# Altium project Analog_Digital.PrjPcb
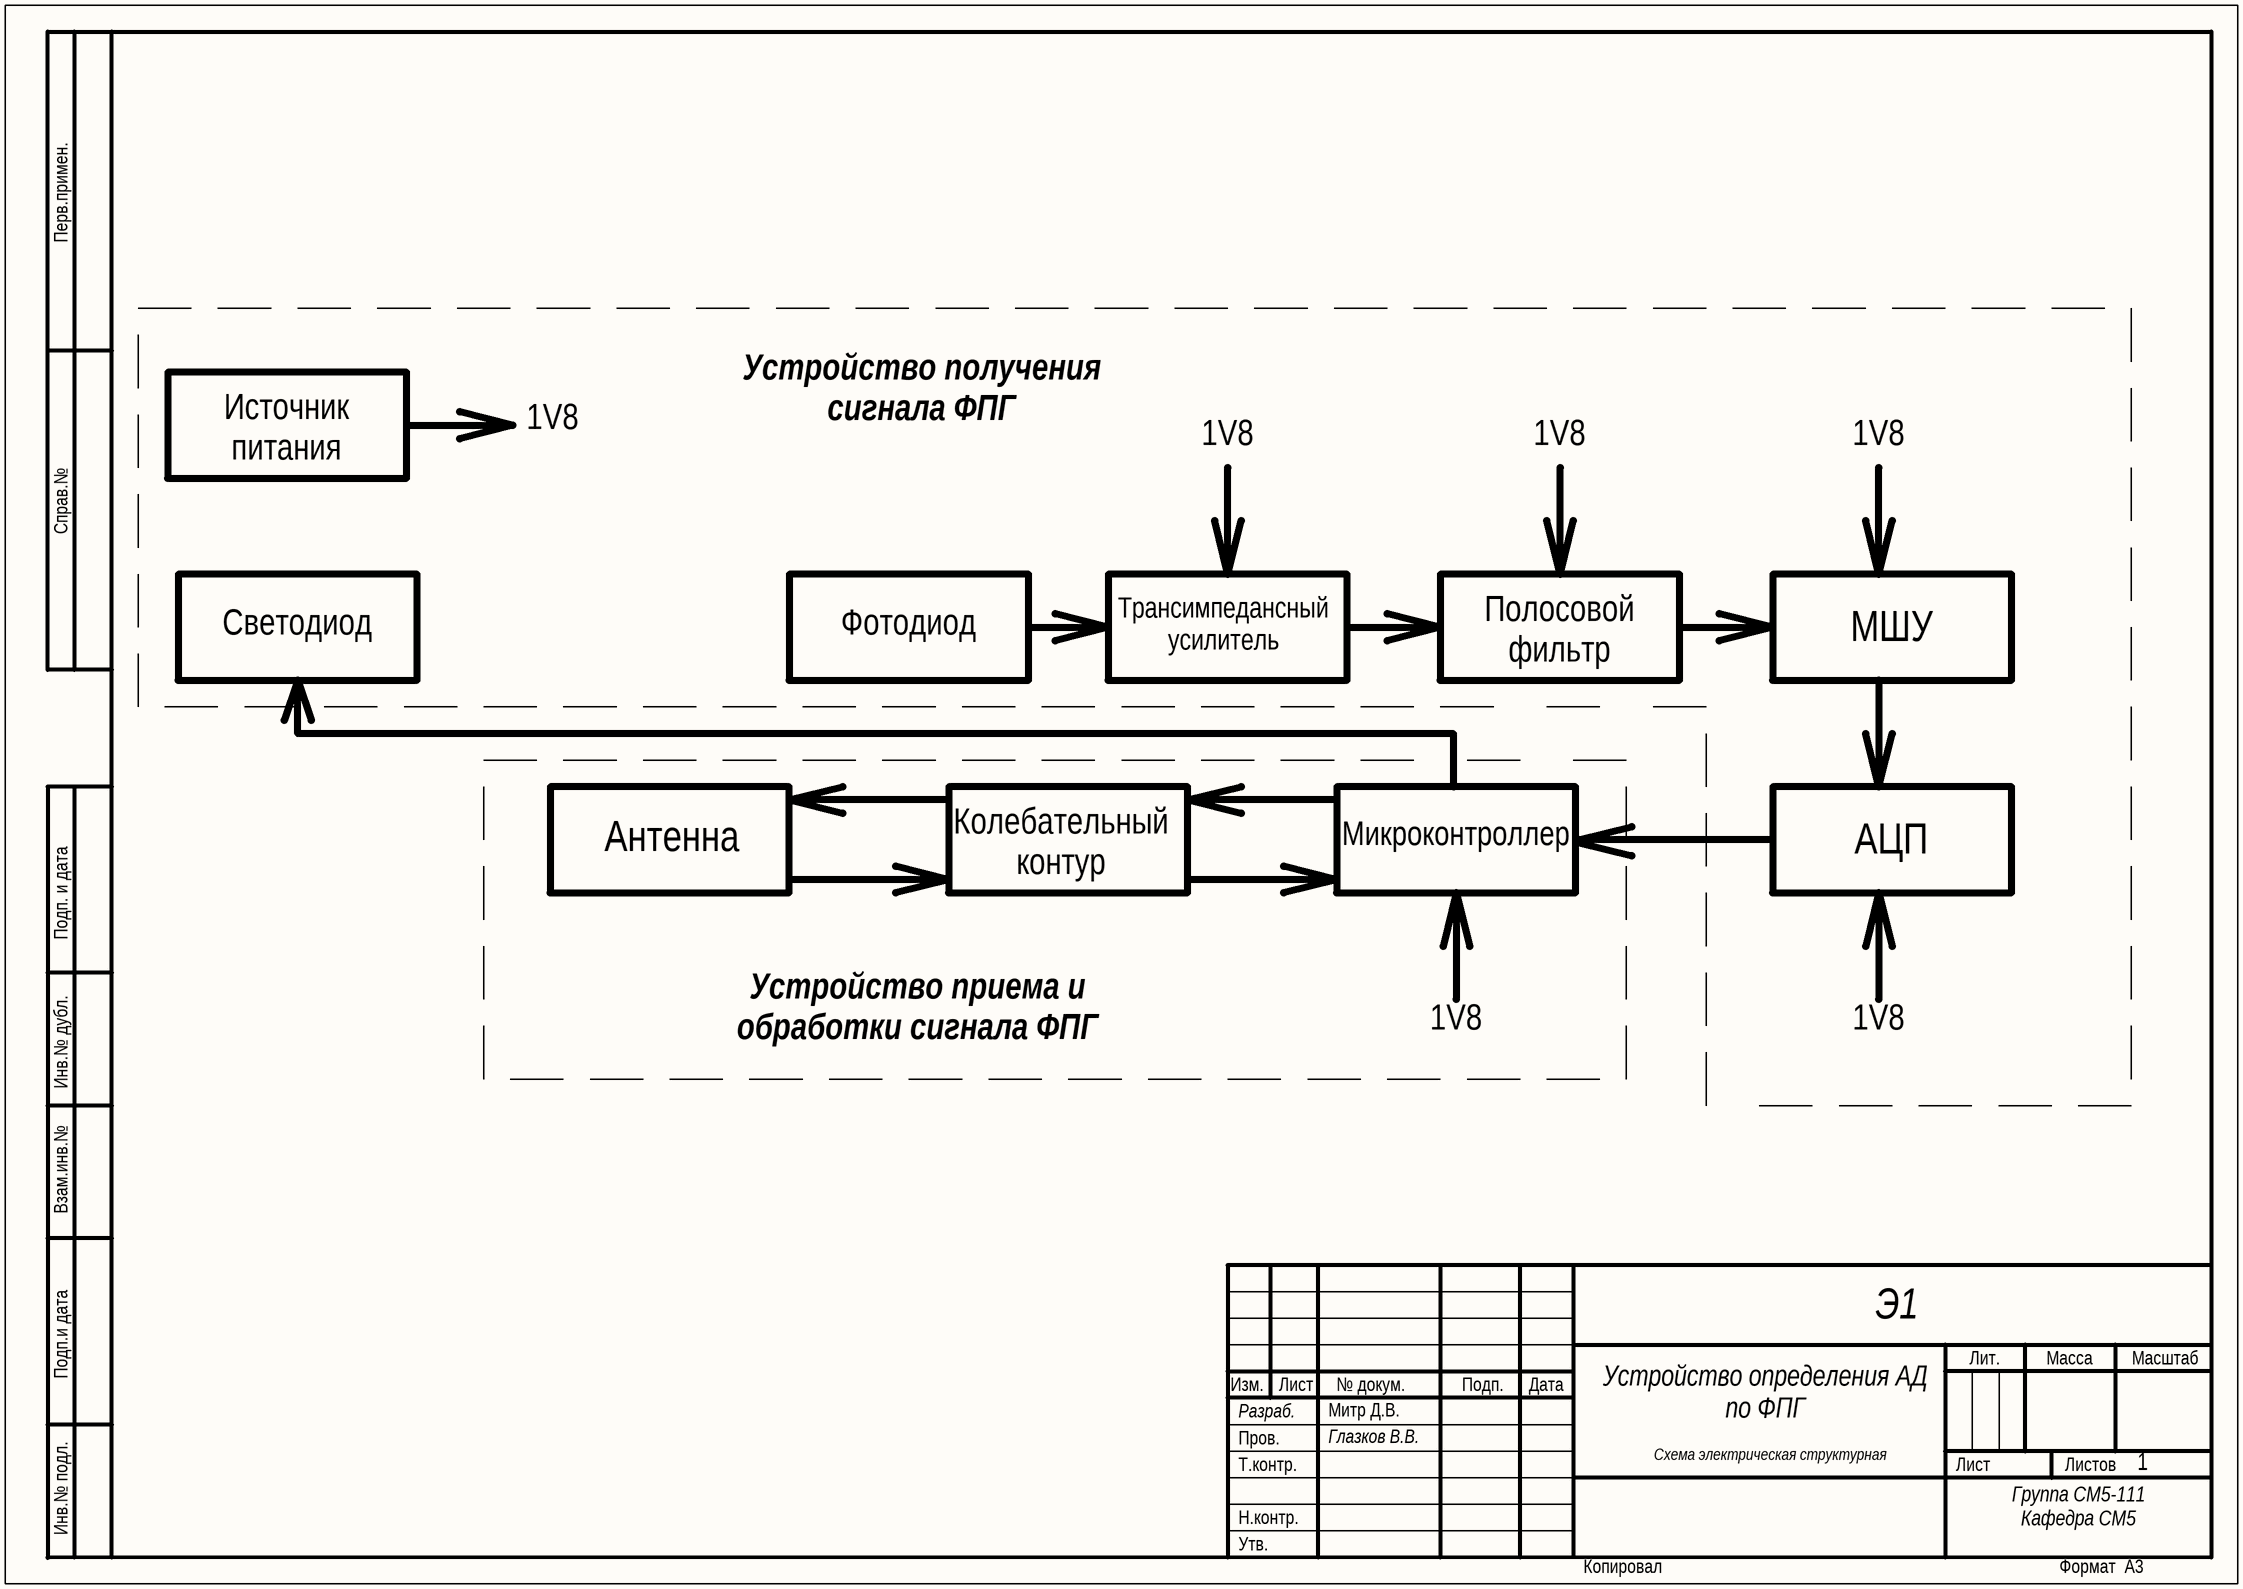
[diagram p0: Analog_Digital_struct.SchDoc]
2 sheets, 2 parts. Net scope: global (net labels, ports and power ports of the same name join across sheets).
Board file: AntDig.PcbDoc
Sheets:
  Analog_Digital_struct.SchDoc
  Analog_Digital_Princ.SchDoc

## Sheet Analog_Digital_struct.SchDoc
size 420 x 297 mm; CheckedBy: Глазков В.В.; Author: Митр Д.В.; SheetNumber: 1; SheetTotal: 2

### Notes on the sheet
- Источник питания
- 1V8
- Устройство получения
  сигнала ФПГ
- Светодиод
- Фотодиод
- Трансимпедансный усилитель
- Полосовой фильтр
- МШУ
- АЦП
- Антенна
- Колебательный контур
- Микроконтроллер
- Устройство приема и обработки сигнала ФПГ
- Э1
- Устройство определения АД по ФПГ
- 1
- Перв.примен.
- Справ.№
- Подп. и дата
- Инв.№ дубл.
- Взам.инв.№
- Подп.и дата
- Разраб.
- Изм.
- Лист
- № докум.
- Подп.
- Дата
- Лит.
- Масса
- Масштаб
- Т.контр.
- Пров.
- Митр Д.В.
- Глазков В.В.
- Схема электрическая структурная
- Листов
- Инв.№ подл.
- Утв.
- Н.контр.
- Группа СМ5-111
  Кафедра СМ5
  МГТУ им Н.Э.Баумана
- Копировал
- Формат  A3

## Sheet Analog_Digital_Princ.SchDoc
size 420 x 297 mm; CheckedBy: Глазков В.В.; Author: Митр Д.В.; SheetNumber: 2; SheetTotal: 2
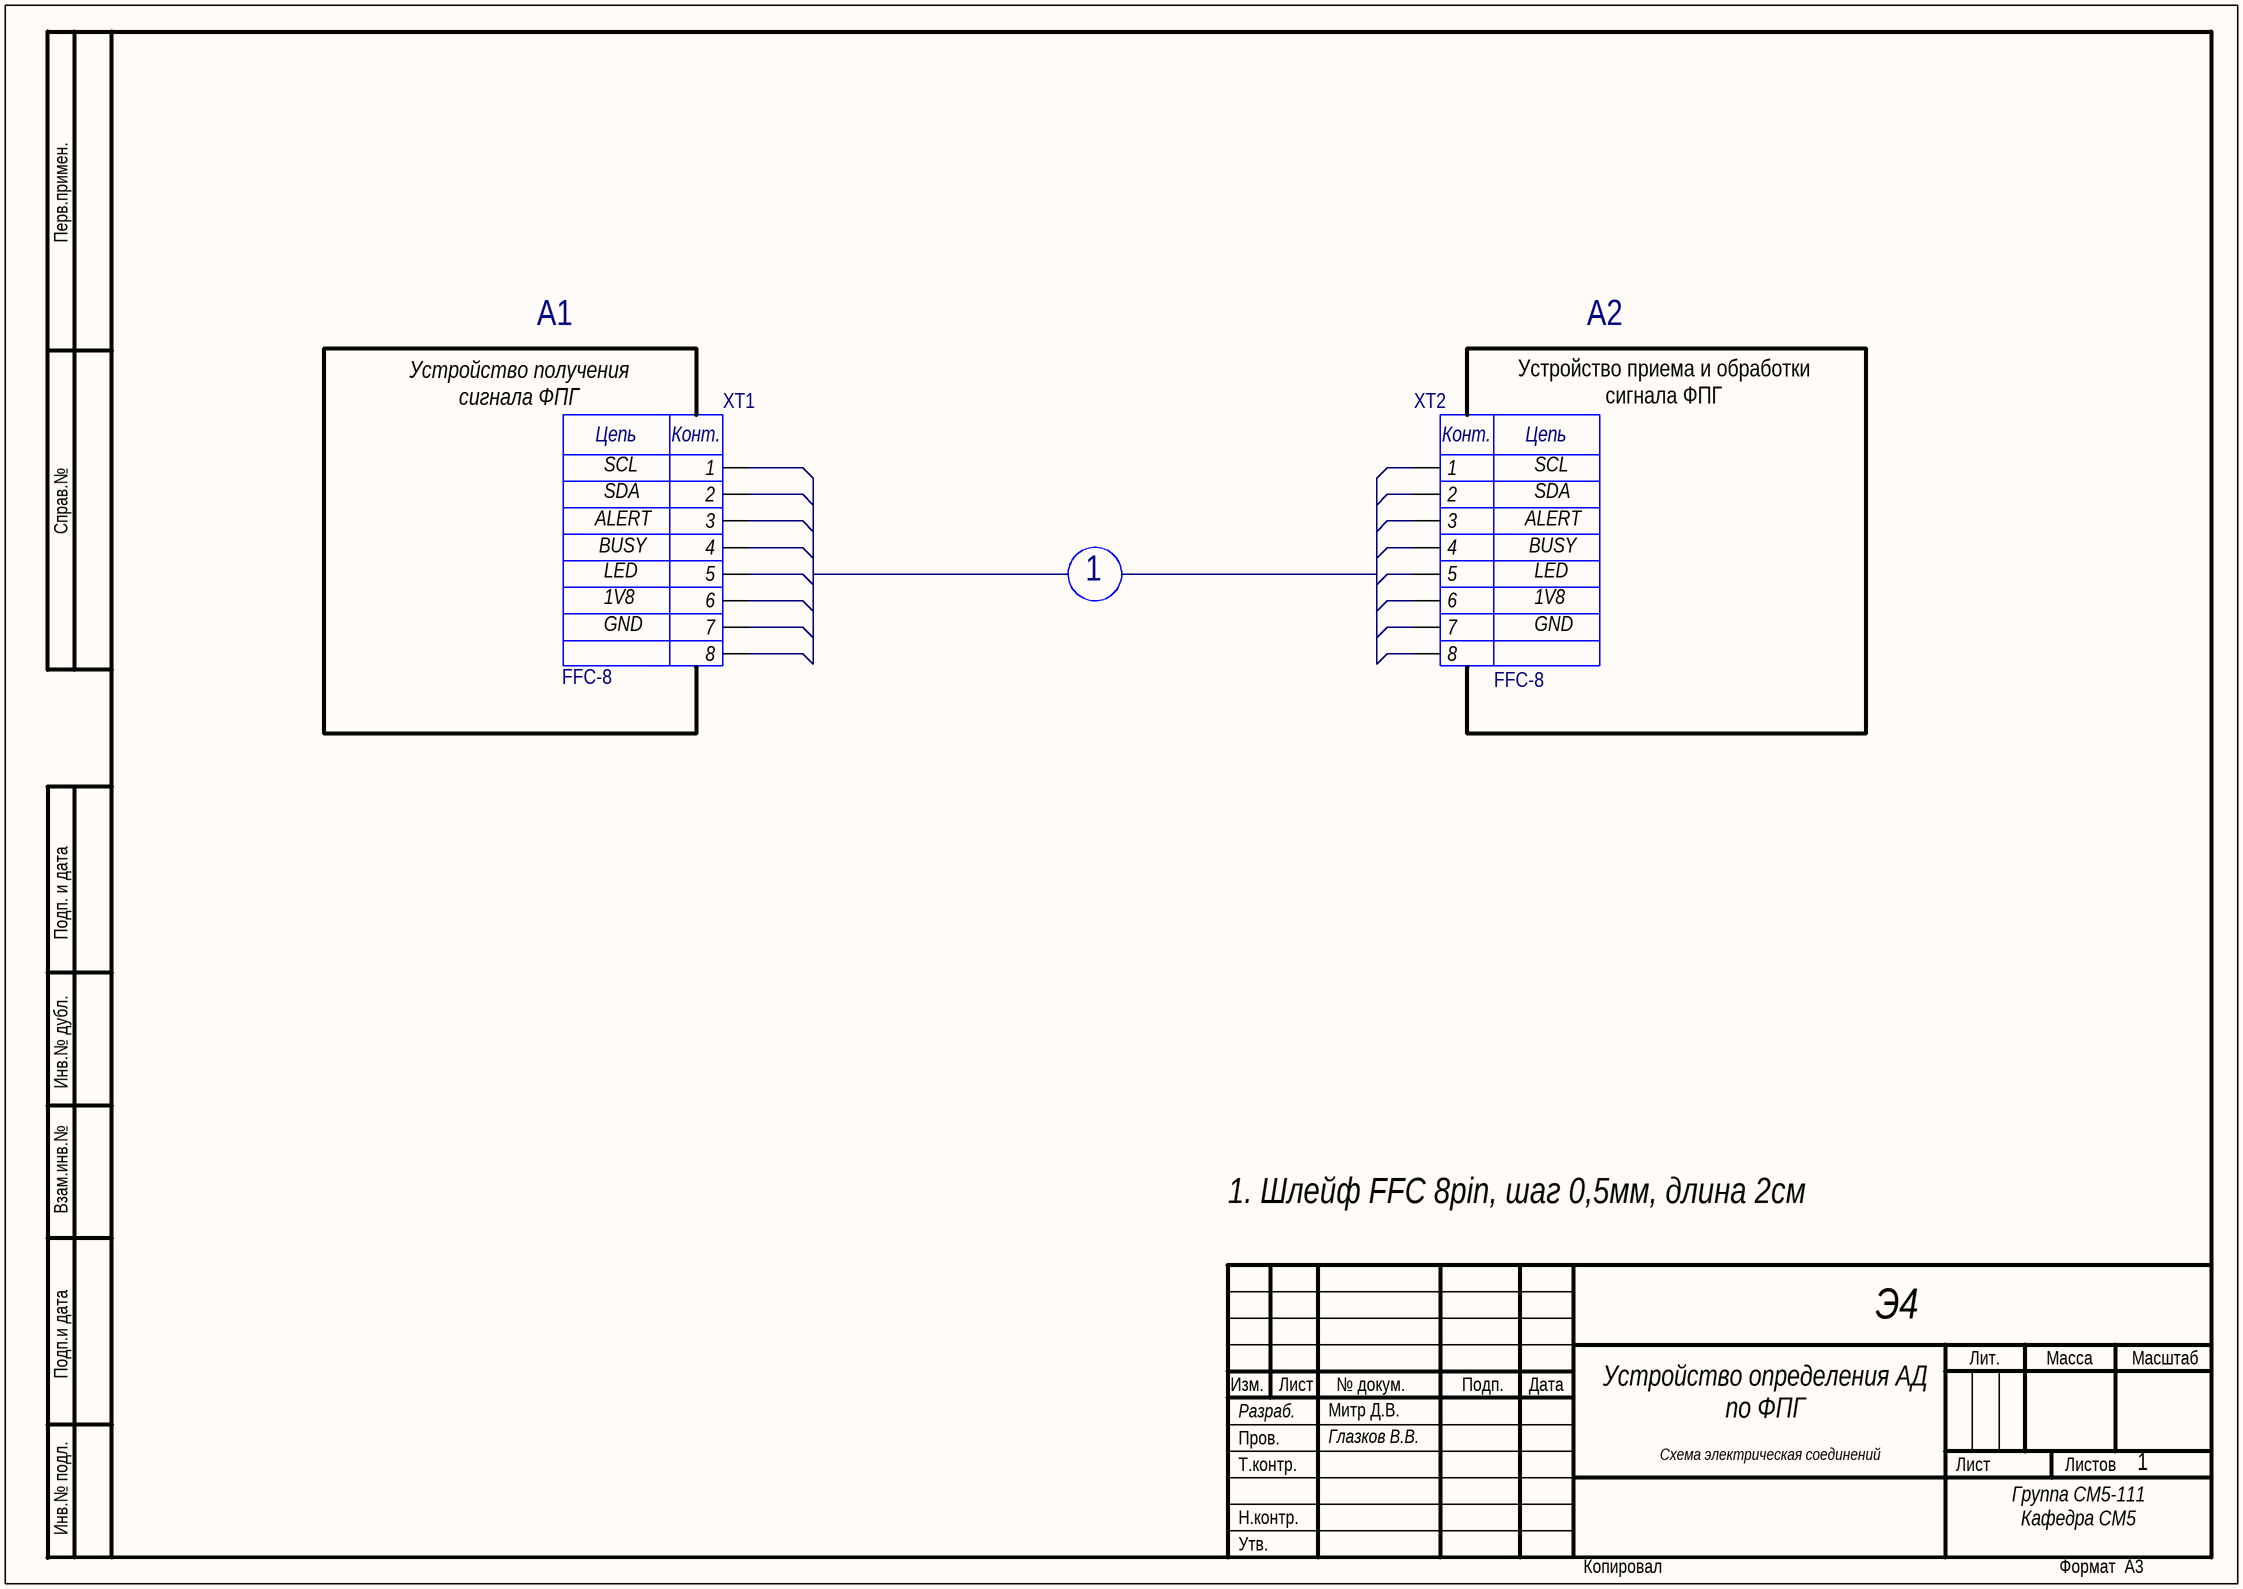
[diagram p1: Analog_Digital_Princ.SchDoc]

### Parts
XT1  name_main: FFC-8  [FFC8]
XT2  name_main: FFC-8  [FFC8]

### Nets

Not connected (* = marked no-connect by the designer): XT1 1 2 3 4 5 6 7 8; XT2 1 2 3 4 5 6 7 8

### Notes on the sheet
- A1
- A2
- Устройство получения
  сигнала ФПГ
- Устройство приема и обработки сигнала ФПГ
- ALERT
- SCL
- SDA
- BUSY
- LED
- 1
- 1V8
- GND
- 1. Шлейф FFC 8pin, шаг 0,5мм, длина 2см
- Э4
- Устройство определения АД по ФПГ
- Перв.примен.
- Справ.№
- Подп. и дата
- Инв.№ дубл.
- Взам.инв.№
- Подп.и дата
- Разраб.
- Изм.
- Лист
- № докум.
- Подп.
- Дата
- Лит.
- Масса
- Масштаб
- Т.контр.
- Пров.
- Митр Д.В.
- Глазков В.В.
- Схема электрическая соединений
- Листов
- Инв.№ подл.
- Утв.
- Н.контр.
- Группа СМ5-111
  Кафедра СМ5
  МГТУ им Н.Э.Баумана
- Копировал
- Формат  A3
- (in symbol FFC8) Цепь; Конт.

### Library data of the parts
XT1 XT2 = FFC8: manufacture: 2328702-8; name: Разъемы